# Altium schematic sheet Schematic1.2.SchDoc
size C; SheetNumber: 1; SheetTotal: 1
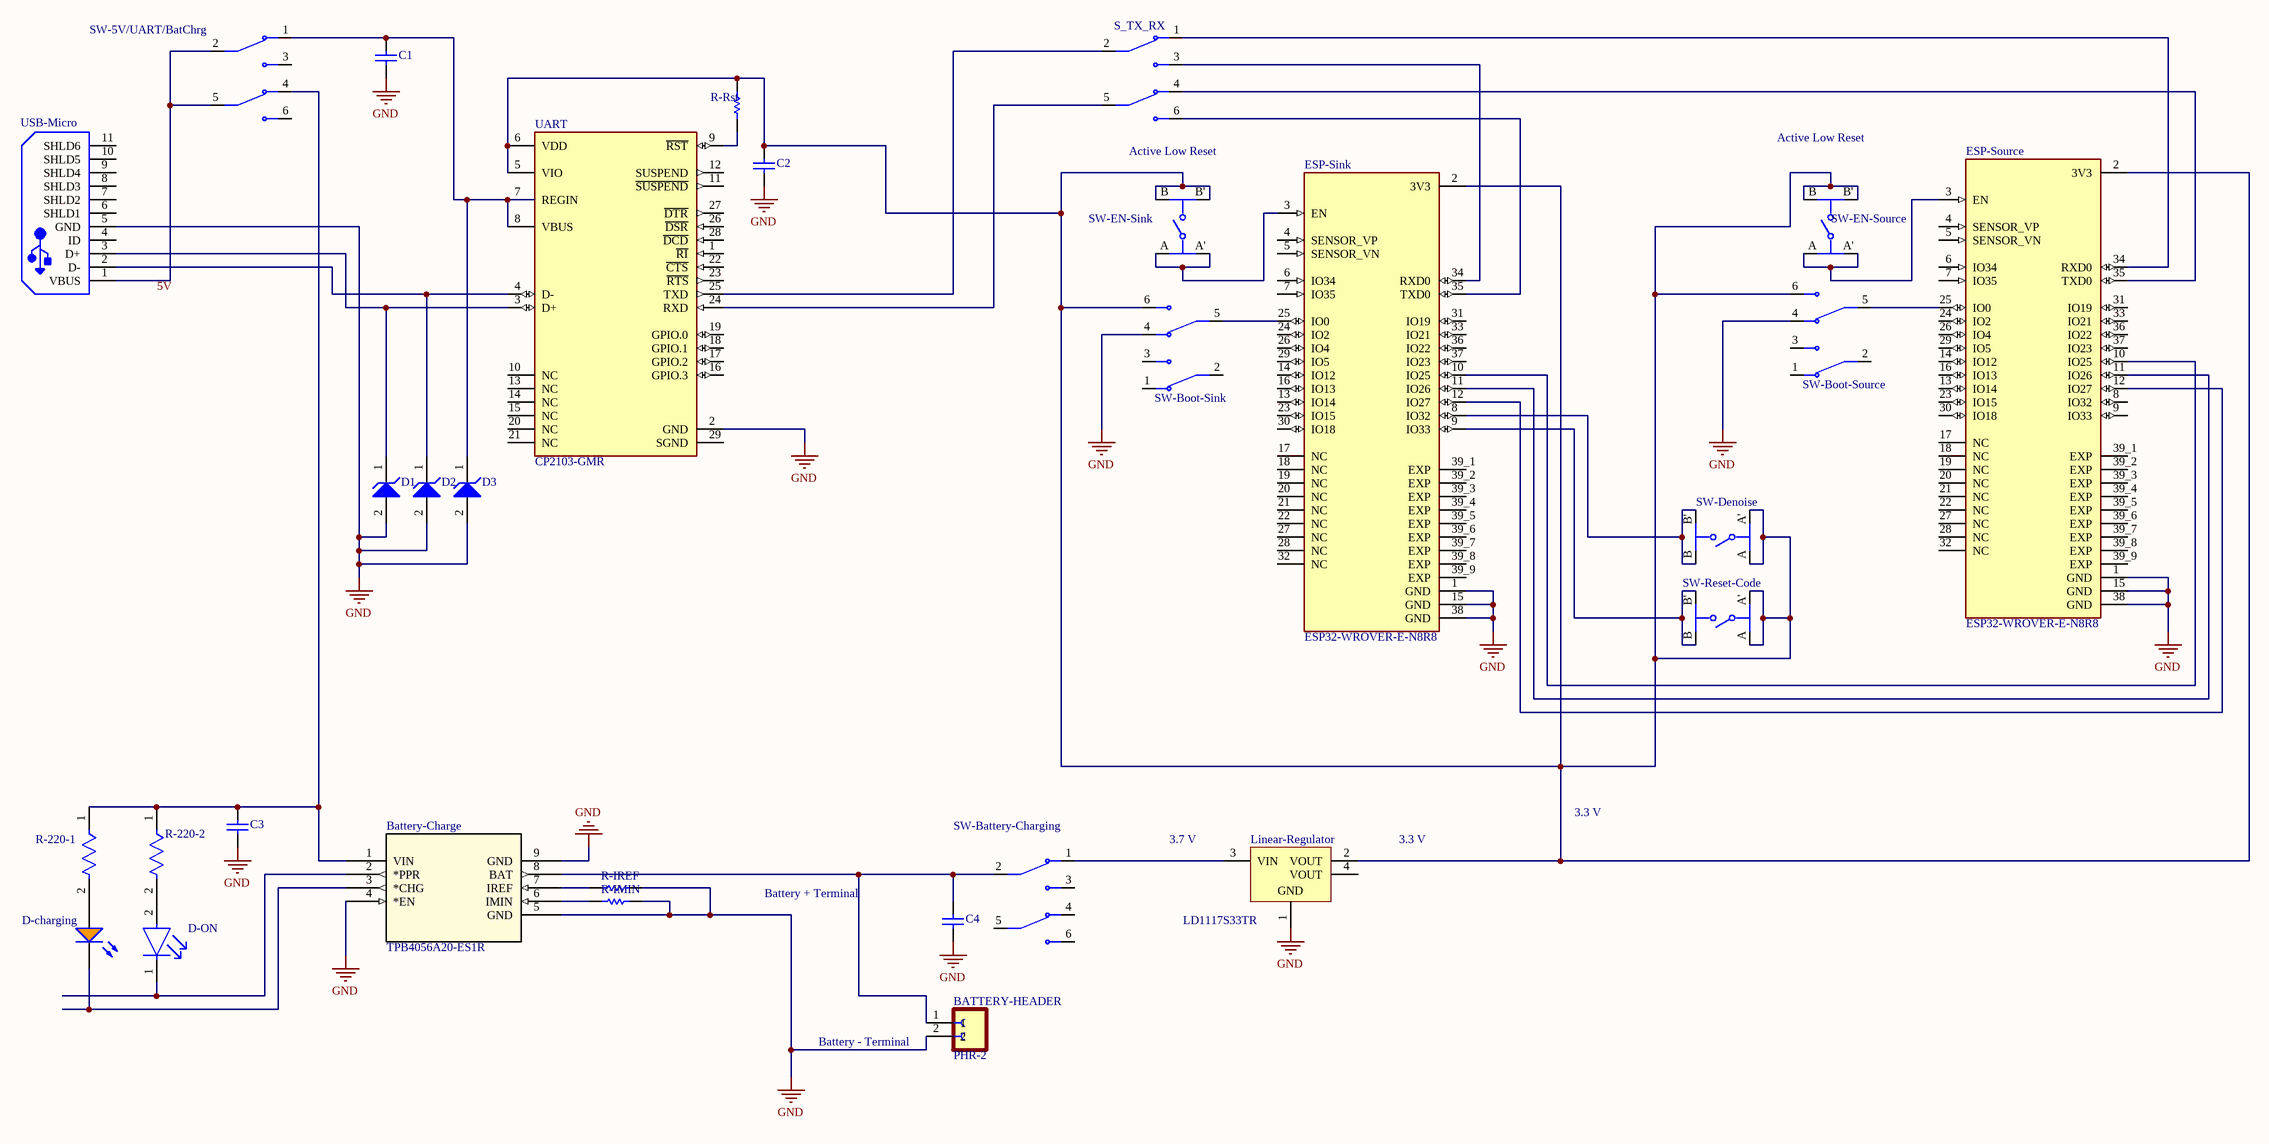
[diagram p0: Schematic1.2.SchDoc]

## Parts
Battery-Charge  TPB4056A20-ES1R  [ESOP-8_TPK]
BATTERY-HEADER  PHR-2  [FP-PHR-2-MFG]
C1  C0603C105K3RACTU  [CAPC1608X87X35LL15T15]  (value not drawn)
C2  C0603C105K3RACTU  [CAPC1608X87X35LL15T15]  (value not drawn)
C3  C0603C105K3RACTU  [CAPC1608X87X35LL15T15]  (value not drawn)
C4  C0603C105K3RACTU  [CAPC1608X87X35LL15T15]  (value not drawn)
D1  MMSZ4691T1G  [ONSC-SOD-123-2-425-04_V]  (value not drawn)
D2  MMSZ4691T1G  [ONSC-SOD-123-2-425-04_V]  (value not drawn)
D3  MMSZ4691T1G  [ONSC-SOD-123-2-425-04_V]  (value not drawn)
D-charging  LTST-C190AKT  [LTST-C190AKT-2_V]  (value not drawn)
D-ON  LTST-C190GKT  [FP-LTST-C190GKT-MFG]  (value not drawn)
ESP-Sink  ESP32-WROVER-E-N8R8  [XCVR_ESP32-WROVER-E-N8R8]
ESP-Source  ESP32-WROVER-E-N8R8  [XCVR_ESP32-WROVER-E-N8R8]
Linear-Regulator  LD1117S33TR  [SOT-223_L]
R-220-1  CRCW0603220RFKEA  [FP-CRCW0603-e3-MFG]  (value not drawn)
R-220-2  CRCW0603220RFKEA  [FP-CRCW0603-e3-MFG]  (value not drawn)
R-IMIN  CRCW0805100KJNEA  [RESC2013X50X30ML20T20]  (value not drawn)
R-IREF  ERJ-3EKF1301V  [RESC1608X55X30NL15T15]  (value not drawn)
R-Rst  RC0603FR-074K7L  [RESC1608X55X25LL10T15]  (value not drawn)
S_TX_RX  SLW-913535-2A-SMT  [SW_SLW-913535-2A-SMT]  (value not drawn)
SW-5V/UART/BatChrg  SLW-913535-2A-SMT  [SW_SLW-913535-2A-SMT]  (value not drawn)
SW-Battery-Charging  SLW-913535-2A-SMT  [SW_SLW-913535-2A-SMT]  (value not drawn)
SW-Boot-Sink  SLW-913535-2A-SMT  [SW_SLW-913535-2A-SMT]  (value not drawn)
SW-Boot-Source  SLW-913535-2A-SMT  [SW_SLW-913535-2A-SMT]  (value not drawn)
SW-Denoise  EVQ-Q2F03W  [FP-EVQ-Q2F03W-MFG]  (value not drawn)
SW-EN-Sink  EVQ-Q2F03W  [FP-EVQ-Q2F03W-MFG]  (value not drawn)
SW-EN-Source  EVQ-Q2F03W  [FP-EVQ-Q2F03W-MFG]  (value not drawn)
SW-Reset-Code  EVQ-Q2F03W  [FP-EVQ-Q2F03W-MFG]  (value not drawn)
UART  CP2103-GMR  [FP-CP2103-GMR-MFG]
USB-Micro  105017-0001  [USB-MICRO-B_V]  (value not drawn)

## Nets
GND: Battery-Charge.4(*EN) Battery-Charge.5(GND) Battery-Charge.9(GND) BATTERY-HEADER.2 C1.1 C2.1 C3.1 C4.1 D1.2(A) D2.2(A) D3.2(A) ESP-Sink.1(GND) ESP-Sink.15(GND) ESP-Sink.38(GND) ESP-Source.1(GND) ESP-Source.15(GND) ESP-Source.38(GND) Linear-Regulator.1(GND) R-IMIN.2 R-IREF.2 SW-Boot-Sink.4 SW-Boot-Source.4 UART.2(GND) USB-Micro.5(GND)
NetBattery-Charge_1: Battery-Charge.1(VIN) C3.2 R-220-1.1 R-220-2.1 SW-5V/UART/BatChrg.4
NetBattery-Charge_2: Battery-Charge.2(*PPR) D-ON.1(C)
NetBattery-Charge_3: Battery-Charge.3(*CHG) D-charging.2(K)
NetBattery-Charge_6: Battery-Charge.6(IMIN) R-IMIN.1
NetBattery-Charge_7: Battery-Charge.7(IREF) R-IREF.1
NetBattery-Charge_8: Battery-Charge.8(BAT) BATTERY-HEADER.1 C4.2 SW-Battery-Charging.2
NetC1_2: C1.2 D3.1(K) SW-5V/UART/BatChrg.1 UART.7(REGIN) UART.8(VBUS)
NetC2_2: C2.2 ESP-Sink.2(3V3) ESP-Source.2(3V3) Linear-Regulator.2(VOUT) R-Rst.2 SW-Boot-Sink.6 SW-Boot-Source.6 SW-Denoise.A SW-Denoise.A' SW-EN-Sink.B SW-EN-Sink.B' SW-EN-Source.B SW-EN-Source.B' SW-Reset-Code.A SW-Reset-Code.A' UART.5(VIO) UART.6(VDD)
NetD1_1: D1.1(K) UART.3(D+) USB-Micro.3(D+)
NetD2_1: D2.1(K) UART.4(D-) USB-Micro.2(D-)
NetD-charging_1: D-charging.1(A) R-220-1.2
NetD-ON_2: D-ON.2(A) R-220-2.2
NetESP-Sink_3: ESP-Sink.3(EN) SW-EN-Sink.A SW-EN-Sink.A'
NetESP-Sink_8: ESP-Sink.8(IO32) SW-Denoise.B SW-Denoise.B'
NetESP-Sink_9: ESP-Sink.9(IO33) SW-Reset-Code.B SW-Reset-Code.B'
NetESP-Sink_10: ESP-Sink.10(IO25) ESP-Source.10(IO25)
NetESP-Sink_11: ESP-Sink.11(IO26) ESP-Source.11(IO26)
NetESP-Sink_12: ESP-Sink.12(IO27) ESP-Source.12(IO27)
NetESP-Sink_25: ESP-Sink.25(IO0) SW-Boot-Sink.5
NetESP-Sink_34: ESP-Sink.34(RXD0) S_TX_RX.3
NetESP-Sink_35: ESP-Sink.35(TXD0) S_TX_RX.6
NetESP-Source_3: ESP-Source.3(EN) SW-EN-Source.A SW-EN-Source.A'
NetESP-Source_25: ESP-Source.25(IO0) SW-Boot-Source.5
NetESP-Source_34: ESP-Source.34(RXD0) S_TX_RX.1
NetESP-Source_35: ESP-Source.35(TXD0) S_TX_RX.4
NetLinear-Regulator_3: Linear-Regulator.3(VIN) SW-Battery-Charging.1
NetR-Rst_1: R-Rst.1 UART.9(~{RST})
NetS_TX_RX_2: S_TX_RX.2 UART.25(TXD)
NetS_TX_RX_5: S_TX_RX.5 UART.24(RXD)
NetSW-5V/UART/BatChrg_2: SW-5V/UART/BatChrg.2 SW-5V/UART/BatChrg.5 USB-Micro.1(VBUS)

Not connected (* = marked no-connect by the designer): ESP-Sink 4(SENSOR_VP) 5(SENSOR_VN) 6(IO34) 7(IO35) 13(IO14) 14(IO12) 16(IO13) 17(NC) 18(NC) 19(NC) 20(NC) 21(NC) 22(NC) 23(IO15) 24(IO2) 26(IO4) 27(NC) 28(NC) 29(IO5) 30(IO18) 31(IO19) 32(NC) 33(IO21) 36(IO22) 37(IO23) 39_1(EXP) 39_2(EXP) 39_3(EXP) 39_4(EXP) 39_5(EXP) 39_6(EXP) 39_7(EXP) 39_8(EXP) 39_9(EXP); ESP-Source 4(SENSOR_VP) 5(SENSOR_VN) 6(IO34) 7(IO35) 8(IO32) 9(IO33) 13(IO14) 14(IO12) 16(IO13) 17(NC) 18(NC) 19(NC) 20(NC) 21(NC) 22(NC) 23(IO15) 24(IO2) 26(IO4) 27(NC) 28(NC) 29(IO5) 30(IO18) 31(IO19) 32(NC) 33(IO21) 36(IO22) 37(IO23) 39_1(EXP) 39_2(EXP) 39_3(EXP) 39_4(EXP) 39_5(EXP) 39_6(EXP) 39_7(EXP) 39_8(EXP) 39_9(EXP); Linear-Regulator 4(VOUT); SW-5V/UART/BatChrg 3 6; SW-Battery-Charging 3 4 5 6; SW-Boot-Sink 1 2 3; SW-Boot-Source 1 2 3; UART 1(~{RI}) 10(NC) 11(~{SUSPEND}) 12(SUSPEND) 13(NC) 14(NC) 15(NC) 16(GPIO.3) 17(GPIO.2) 18(GPIO.1) 19(GPIO.0) 20(NC) 21(NC) 22(~{CTS}) 23(~{RTS}) 26(~{DSR}) 27(~{DTR}) 28(~{DCD}) 29(SGND); USB-Micro 4(ID) 6(SHLD1) 7(SHLD2) 8(SHLD3) 9(SHLD4) 10(SHLD5) 11(SHLD6)

## Notes on the sheet
- Active Low Reset
- (near Linear-Regulator) 3.7 V
- 3.3 V
- Battery + Terminal
- (near BATTERY-HEADER) Battery - Terminal
- Labels drawn without touching a wire or pin: 5V

## Library data of the parts
Battery-Charge = TPB4056A20-ES1R: No Description Available; Mfr_Name: 3Peak; RefDes: RefDes; Type: Type; Supplier 1: Digikey; Supplier Part Number 1: 5503-TPB4056A20-ES1RCT-ND
BATTERY-HEADER = CMP-002-00071-2: PH Series 2 Position 2 mm Pitch Free Hanging Housing Connector; Availability: Unavailable; Price: None; Design Item ID: PHR-2; Value: *; Component Type: Standard; Source: PHR-2.SchLib; Pins: 2; MP: PHR-2; Case/Package: None
C1-C4 = CMP-2006-03713-1: Manufacturer: Kemet; Dielectric Material: Ceramic; Value: 1uF; Multilayer: Yes; Tolerance  (fill in as +-): 10%; Rated DC Voltage (URdc): 25V; Temperature Characteristics Code: X7R; Part Number: C0603C105K3RACTU; Supplier: Mouser; Supplier Part Number: 80-C0603C105K3R; Manufacturer Part Number: C0603C105K3RACTU; RoHS: Yes; Category: Ceramic Capacitors; Stock: 8675; Pricing: 1=0.25, 10=0.156, 50=0.156, 100=0.119, 500=0.112, 1000=0.107, 4000=0.06, 8000=0.058, 10000=0.058 (USD); Mounting Technology: Surface Mount; Pins: 2; Package Shape: Rectangular; Case/Package: 0603; Terminal Finish: Nickel; Min Operating Temperature: -55°C; Max Operating Temperature: 125°C; JESD-609 Code: e3; Capacitor Type: Ceramic; Package Style: SMTMeter; Packaging: Tape and Reel; Tolerance (fill in as +-): 10%; Termination: Wraparound; Length: 1.6mm; Width: 0.8mm; Height: 0.8mm; Reach SVHC Compliant: Yes; RoHS Compliant: Yes; ComponentLink1URL: https://datasheet.ciiva.com:443/pdfs/VipMasterIC/IC/KEME/KEME-S-A0008991654/KEME-S-A0008991654-1.pdf?src-supplier=IHS+Markit; ComponentLink1Description: https://datasheet.ciiva.com:443/pdfs/VipMasterIC/IC/KEME/KEME-S-A0008991654/KEME-S-A0008991654-1.pdf?src-supplier=IHS+Markit; ComponentLink2URL: http://www.farnell.com/datasheets/2740425.pdf?src-supplier=Farnell; ComponentLink2Description: http://www.farnell.com/datasheets/2740425.pdf?src-supplier=Farnell; ComponentLink3URL: http://uk.rs-online.com/webdocs/1528/0900766b81528de6.pdf?src-supplier=Rs; ComponentLink3Description: http://uk.rs-online.com/webdocs/1528/0900766b81528de6.pdf?src-supplier=Rs; ComponentLink4URL: http://components.arrow.com/part/dataview/53683125S181328N7429?src-supplier=Arrow+Electronics; ComponentLink4Description: http://components.arrow.com/part/dataview/53683125S181328N7429?src-supplier=Arrow+Electronics; ComponentLink5URL: http://www.farnell.com/datasheets/2740425.pdf?src-supplier=Element14; ComponentLink5Description: http://www.farnell.com/datasheets/2740425.pdf?src-supplier=Element14; ComponentLink6URL: http://www.kemet.com/Lists/ProductCatalog/Attachments/53/KEM_C1002_X7R_SMD.pdf?src-supplier=Avnet; ComponentLink6Description: http://www.kemet.com/Lists/ProductCatalog/Attachments/53/KEM_C1002_X7R_SMD.pdf?src-supplier=Avnet; ComponentLink7URL: http://www.farnell.com/datasheets/2740425.pdf?src-supplier=Newark; ComponentLink7Description: http://www.farnell.com/datasheets/2740425.pdf?src-supplier=Newark; ComponentLink8URL: https://api.kemet.com/component-edge/download/datasheet/C0603C105K3RACTU.pdf?src-supplier=Digikey; ComponentLink8Description: https://api.kemet.com/component-edge/download/datasheet/C0603C105K3RACTU.pdf?src-supplier=Digikey; ComponentLink9URL: https://datasheet.octopart.com/C0603C105K3RACTU-KEMET-datasheet-164512540.pdf?src-supplier=TME; ComponentLink9Description: https://datasheet.octopart.com/C0603C105K3RACTU-KEMET-datasheet-164512540.pdf?src-supplier=TME
D1-D3 = CMP-1060-00606-1: Zener Voltage Regulator, 500 mW, 2-Pin SOD-123, Pb-Free, Tape and Reel; Manufacturer: On Semiconductor; VZ Typ (V): 6.2; P Max (W): 0.5; DatasheetVersion: Rev. 9; ComponentLink1Description: Manufacturer URL; PackageReference: SOD-123-2-425-04; PartNumber: MMSZ4691T1G; RoHS: Pb-Free; Mounting Technology: Surface Mount; ComponentLink3URL: http://www.onsemi.com/pub_link/Collateral/425-04.PDF; Packing: Tape and Reel; ComponentLink2URL: http://www.onsemi.com/pub_link/Collateral/MMSZ4678T1-D.PDF; PackageVersion: Rev. G, 10/2009; ComponentLink1URL: http://www.onsemi.com/; PackageDescription: 2-Pin SOD, Body 1.6 x 2.69 mm; ComponentLink2Description: Datasheet; ComponentLink3Description: Package Specification
D-charging = CMP-1674-00006-1: Single Color Chip LED, 2.1 V, 2 mcd, -55 to 85 degC, 2-Pin SMD, RoHS, Tape and Reel; PackageDescription: 2-Pin Surface Mount Device, Body 1.6 x 0.8 mm; ComponentLink1URL: http://www.us.liteon.com/; ComponentLink1Description: Manufacturer URL; PackageReference: LTST-C190AKT-2; ComponentLink2Description: Datasheet; DatasheetVersion: Jan-03; ComponentLink2URL: http://datasheet.octopart.com/LTST-C190AKT-Lite-On-datasheet-11729267.pdf
D-ON = CMP-22017-000005-2: LED GREEN CLEAR CHIP SMD; Dominant Wavelength: 569nm; Reverse Voltage: 5V; Lens Color: Colorless; Viewing Angle: 130°; Voltage: 2V; Forward Current: 30mA; Power Dissipation: 100mW; Luminous Intensity: 6mcd; Number of LEDs: 1; Forward Voltage: 2.1V; Wavelength: 565nm; Test Current: 10mA; Min Operating Temperature: -55°C; Lens Style: Clear; Mount: Surface Mount; Width: 0.8mm; Packaging: Tape and Reel; Lens Transparency: Clear; Case Code (Metric): 1608; Depth: 0.8mm; Case Code (Imperial): 0603; Case/Package: 0603; Number of Pins: 2; Max Operating Temperature: 85°C; Lead Free: Lead Free; Number of Elements: 1; Length: 1.6mm; Height: 0.8mm; Package Quantity: 1; Power Rating: 100mW; Radiation Hardening: No; Illumination Color: Green; Color: Green
ESP-Sink ESP-Source = CMP-005-000000-2: Multiprotocol Modules SMD Module ESP32-WROVER-E, ESP32-D0WD-V3, 3.3V 64Mbit PSRAM, 8 MB SPI flash, PCB Antenna; MP: ESP32-WROVER-E-N8R8; Availability: Unavailable; Price: None; Component Type: Standard; Package: None; Design Item ID: ESP32-WROVER-E-N8R8; Source: ESP32-WROVER-E-N8R8.SchLib; Value: *; Pin Count: 47
Linear-Regulator = CMP-0244-00310-1: Fixed Low Drop Positive Voltage Regulator, 3.3V, 4-Pin SOT-223, Tape and Reel; ComponentLink2Description: Datasheet; PackageDescription: 4-Pin SOT-223 Package, 6.5 x 3.5 mm Body, 2.3 mm Pitch, 7 mm Lead Span; PackageVersion: 2010; ComponentLink2URL: http://www.st.com/internet/com/TECHNICAL_RESOURCES/TECHNICAL_LITERATURE/DATASHEET/CD00000544.pdf; PackageReference: SOT-223; DatasheetVersion: 1/11/2011; ComponentLink1Description: Manufacturer URL; ComponentLink1URL: http://www.st.com
R-220-1 R-220-2 = CMP-2000-03085-2: RES Thick Film, 220Ω, 1%, 0.1W, 100ppm/°C, 0603; Power Rating: 100mW; Voltage Rating: 75V; Resistance: 220R; Contact Plating: Tin; Package Quantity: 10; Lead Free: Lead Free; Packaging: Tape and Reel; Max Operating Temperature: 155°C; Case/Package: 0603; Radiation Hardening: No; Height: 0.45mm; Width: 0.033inch; Case Code (Imperial): 0603; Number of Terminations: 2; Tolerance: 1%; Min Operating Temperature: -55°C; Termination: SMD/SMT; Length: 1.55mm; Features: Automotive AEC-Q200; Voltage Rating (DC): 75V; Case Code (Metric): 1608; Composition: Thick Film; Military Standard: Not; Temperature Coefficient: 100ppm/°C; Depth: 0.85mm; Weight: 7.1E-05oz; Max Power Dissipation: 100mW
R-IMIN = CMP-2001-04900-1: Manufacturer: Vishay Dale; Tolerance: 5%; Power: 125mW; Rated Temperature: 70°C; Value: 100kR; Working Voltage: 150V; Temperature Coefficient (ppm/Cel): 200; Package Height: 0.45mm; Package Length: 2mm; Package Width: 1.25mm; Reference Standard: AEC-Q200; Part Number: CRCW0805100KJNEA; Supplier: Mouser; Supplier Part Number: 71-CRCW0805J-100K-E3; Manufacturer Part Number: CRCW0805100KJNEA; RoHS: Yes; Category: Chip SMD Resistors; Stock: 127338; Pricing: 1=0.1, 10=0.022, 50=0.022, 100=0.018, 1000=0.011, 10000=0.004 (USD); Mounting Technology: Surface Mount; Pins: 2; Case/Package: 0805; Terminal Finish: Nickel; Package Shape: Rectangular; Min Operating Temperature: -55°C; Max Operating Temperature: 155°C; Resistor Type: FIXED RESISTOR; Construction: Chip; Packaging: Tape and Reel; Technology: METAL GLAZE/THICK FILM; Termination: Wraparound; JESD-609 Code: e3; Reach SVHC Compliant: Yes; RoHS Compliant: Yes; ComponentLink1URL: https://datasheet.ciiva.com:443/pdfs/VipMasterIC/IC/VISH/VISH-S-A0007266705/VISH-S-A0007266705-1.pdf?src-supplier=IHS+Markit; ComponentLink1Description: https://datasheet.ciiva.com:443/pdfs/VipMasterIC/IC/VISH/VISH-S-A0007266705/VISH-S-A0007266705-1.pdf?src-supplier=IHS+Markit
R-IREF = CMP-2000-00232-1: Manufacturer: Panasonic; Tolerance: 1%; Power: 100mW; Value: 1.3kR; Working Voltage: 75V; Temperature Coefficient (ppm/Cel): 100; Rated Temperature: 70°C; Package Height: 0.45mm; Package Length: 1.6mm; Package Width: 0.8mm; Reference Standard: AEC-Q200; Part Number: ERJ-3EKF1301V; Supplier: Mouser; Supplier Part Number: 667-ERJ-3EKF1301V; Manufacturer Part Number: ERJ-3EKF1301V; RoHS: Yes; Category: Chip SMD Resistors; Stock: 69323; Pricing: 1=0.1, 10=0.03, 50=0.03, 100=0.017, 500=0.014, 1000=0.009, 5000=0.007, 10000=0.006, 25000=0.005 (USD); Mounting Technology: Surface Mount; Pins: 2; Case/Package: 0603; Terminal Finish: Nickel; Package Shape: Rectangular; Min Operating Temperature: -55°C; Max Operating Temperature: 155°C; Resistor Type: FIXED RESISTOR; Packaging: Tape and Reel; Technology: METAL GLAZE/THICK FILM; Termination: Wraparound; Construction: Rectangular; JESD-609 Code: e3; RoHS Compliant: Yes; Reach SVHC Compliant: Yes; ComponentLink1URL: https://datasheet.ciiva.com:443/pdfs/VipMasterIC/IC/PANA/PANA-S-A0009889626/PANA-S-A0009889626-1.pdf?src-supplier=IHS+Markit; ComponentLink1Description: https://datasheet.ciiva.com:443/pdfs/VipMasterIC/IC/PANA/PANA-S-A0009889626/PANA-S-A0009889626-1.pdf?src-supplier=IHS+Markit; ComponentLink2URL: https://datasheet.ciiva.com/46374/426256-46374156.pdf?src-supplier=Element14; ComponentLink2Description: https://datasheet.ciiva.com/46374/426256-46374156.pdf?src-supplier=Element14; ComponentLink3URL: https://datasheet.ciiva.com/46387/426256-46387020.pdf?src-supplier=Element14; ComponentLink3Description: https://datasheet.ciiva.com/46387/426256-46387020.pdf?src-supplier=Element14; ComponentLink4URL: https://datasheet.ciiva.com/6137/426256-6137483.pdf?src-supplier=Farnell; ComponentLink4Description: https://datasheet.ciiva.com/6137/426256-6137483.pdf?src-supplier=Farnell; ComponentLink5URL: https://datasheet.ciiva.com/28593/1678782-28593215.pdf?src-supplier=Element14; ComponentLink5Description: https://datasheet.ciiva.com/28593/1678782-28593215.pdf?src-supplier=Element14; ComponentLink6URL: https://datasheet.ciiva.com/43460/426256-43460476.pdf?src-supplier=Farnell; ComponentLink6Description: https://datasheet.ciiva.com/43460/426256-43460476.pdf?src-supplier=Farnell; ComponentLink7URL: https://datasheet.ciiva.com/24165/aoa0000ce2-24165718.pdf?src-supplier=Mouser; ComponentLink7Description: https://datasheet.ciiva.com/24165/aoa0000ce2-24165718.pdf?src-supplier=Mouser; ComponentLink8URL: https://datasheet.ciiva.com/16788/70260748-16788053.pdf?src-supplier=Allied+Electronics; ComponentLink8Description: https://datasheet.ciiva.com/16788/70260748-16788053.pdf?src-supplier=Allied+Electronics; ComponentLink9URL: https://datasheet.ciiva.com/30261/aoa0000ce2-30261979.pdf?src-supplier=Onlinecomponents.com; ComponentLink9Description: https://datasheet.ciiva.com/30261/aoa0000ce2-30261979.pdf?src-supplier=Onlinecomponents.com
R-Rst = CMP-2000-06942-1: Chip Resistor, 4.7 KOhm, +/- 1%, 0.1 W, -55 to 155 degC, 0603 (1608 Metric), RoHS, Tape and Reel; Manufacturer: Yageo; Power Rating: 100mW; Temperature Coefficient: 100PPM/C; Resistance: 4.7kOhms; Voltage Rating: 50V; Package Reference: 0603; Series: RC; Datasheet Version: Rev. 7, 05/2017; Packaging: Reel; Termination Style: SMD/SMT; Datasheet URL: http://www.yageo.com/documents/recent/PYu-RC_Group_51_RoHS_L_7.pdf; Manufacturer URL: http://www.yageo.com/; Package Description: 2-Pin Surface Mount Device, Body 1.6 x 0.8 mm; Case Code - mm: 1608; Case Code - in: 0603; Mounting Technology: SurfaceMount; Operating Temperature Range: -55Cto+155C; Tolerance: 1%; Product: ThickFilmResistorsGeneralPurpose
S_TX_RX SW-5V/UART/BatChrg SW-Battery-Charging SW-Boot-Sink SW-Boot-Source = CMP-007-000000-2: Switch Slide ON ON DPDT Raised Slide 0.1A 12VDC 10000Cycles Gull Wing SMD Box; Package: None; Availability: Unavailable; Price: None; Source: SLW-913535-2A-SMT.SchLib; Component Type: Standard; MP: SLW-913535-2A-SMT; Value: *; Pin Count: 6; Design Item ID: SLW-913535-2A-SMT
SW-Denoise SW-EN-Sink SW-EN-Source SW-Reset-Code = CMP-05618-000127-1: SWITCH TACTILE SPST-NO 0.02A 15V; Body Depth: 6mm; Illumination Type: Non-Illuminated; Mechanical Life: 1000000Cycles; Switch Travel: 0.2mm; Actuator Length: 1.3mm; Max Voltage Rating (AC): 250V; Contact Resistance: 100mR; Operating Force: 1N; Current Rating: 20mA; Switch Function: Off-Mom; Actuator Color: White; Number of Poles: 1; Throw Configuration: SPST; Actuator Type: Standard; Contact Plating: Gold; Lead Free: Lead Free; Package Quantity: 1; Radiation Hardening: No; Depth: 6.6mm; Termination: SMD/SMT; Voltage Rating (AC): 250V; Size: 1.8mm; Thickness: 1.8mm; Height: 3.1mm; Mount: Surface Mount; Contact Current Rating: 20mA; Color: White; Width: 6.5mm; Series: EVQQ2; Max Operating Temperature: 85°C; Min Operating Temperature: -40°C; Packaging: Tape and Reel; Voltage Rating (DC): 15V; RoHS Compliant: Yes; Length: 6mm; Max Voltage Rating (DC): 15V; Max Current Rating: 20mA; Case/Package: SMD/SMT; Orientation: Straight; Electrical Life: 1000000Cycles
UART = CMP-08107-000005-1: IC CTRLR BRIDGE USB-UART 28MLP; Manufacturer: Silicon Labs; Nominal Supply Current: 20mA; Interface: UART,USB,RS-232,RS-485; Max Supply Voltage: 3.6V; Min Supply Voltage: 1.8V; Standoff Height: 0.03mm; Function: Bridge, USB to UART; ComponentLink2Description: Datasheet; Automotive: No; Device Class L1: Integrated Circuits (ICs); Ambient Temperature Range Low: -55°C; Digikey Description: IC CTRLR BRIDGE USB-UART 28MLP; Temperature Range Low: -40°C; Category: IC; Ambient Temperature Range High: +125°C; Ipc Land Pattern Name: QFN50P500X500X90-28; Device Class L2: Interface ICs; Temperature Range High: +85°C; Mouser Description: I/O Controller Interface IC USB-TO-UART BRIDGE; Octopart: https://octopart.com/cp2103-gmr-silicon+labs-519938; RoHS: TRUE; ComponentLink2URL: https://www.silabs.com/documents/public/data-sheets/CP2103.pdf; Lead Free: Yes; Height: 1mm; Package: 0; Device Class L3: Controllers; Manufacturer Part Number: CP2103-GMR; Temperature: -40°C to +85°C
USB-Micro = CMP-2000-05827-1: Micro-USB B Receptacle, Right Angle, Bottom Mount, Surface Mount, with Solder Tabs, -30 to 85 degC, 5-Pin USB, RoHS, Tape and Reel; Manufacturer: Molex; Featured Product: Micro-USBConnectorsUSBConnectors; Other Names: WM1399DKR; Package Version: Rev. F, 12/2012; Number of Contacts: 5; Connector Type: USB-microB; Catalog Drawings: 1050170001; 3D Model: 105017-0001.stp; Mating Products: WM17145-ND-CABLEMICROUSBBTOSTDA1.0MWM17147-ND-CABLEMICROUSBBTOSTDA2.0MWM17146-ND-CABLEMICROUSBBTOSTDA1.5M; PCN Assembly/Origin: ResinSupplier21/Oct/2015; Voltage - Max: 30V; Online Catalog: Molex-MicroUSB; Manufacturer URL: http://www.molex.com/; Package Description: 5-Leads USB, Micro B, Body 7.5 x 5 mm, Pitch 0.65 mm; Datasheet URL: http://www.molex.com/elqNow/elqRedir.htm?ref=http://www.molex.com/webdocs/datasheets/pdf/en-us/1050170001_IO_CONNECTORS.pdf; Ingress Protection: -; Datasheet Version: 03/2016; Mounting Type: BoardCutout,SurfaceMount,RightAngle; Circuits: 5; Standard Package: 1; Package Reference: MICRO-B; Package URL: http://www.molex.com/pdm_docs/sd/1050170001_sd.pdf; Category: Connectors,Interconnects; Series: -; RoHS Information: 1050170001CertofCompliance; Features: Shielded,SolderRetention; Family: USB,DVI,HDMIConnectors; Specifications: -; Gender: Receptacle; Packaging: Digi-Reel®; Mounting Technology: SurfaceMount